# EAGLE design MPPT_LCD (EAGLE 7.4.0)
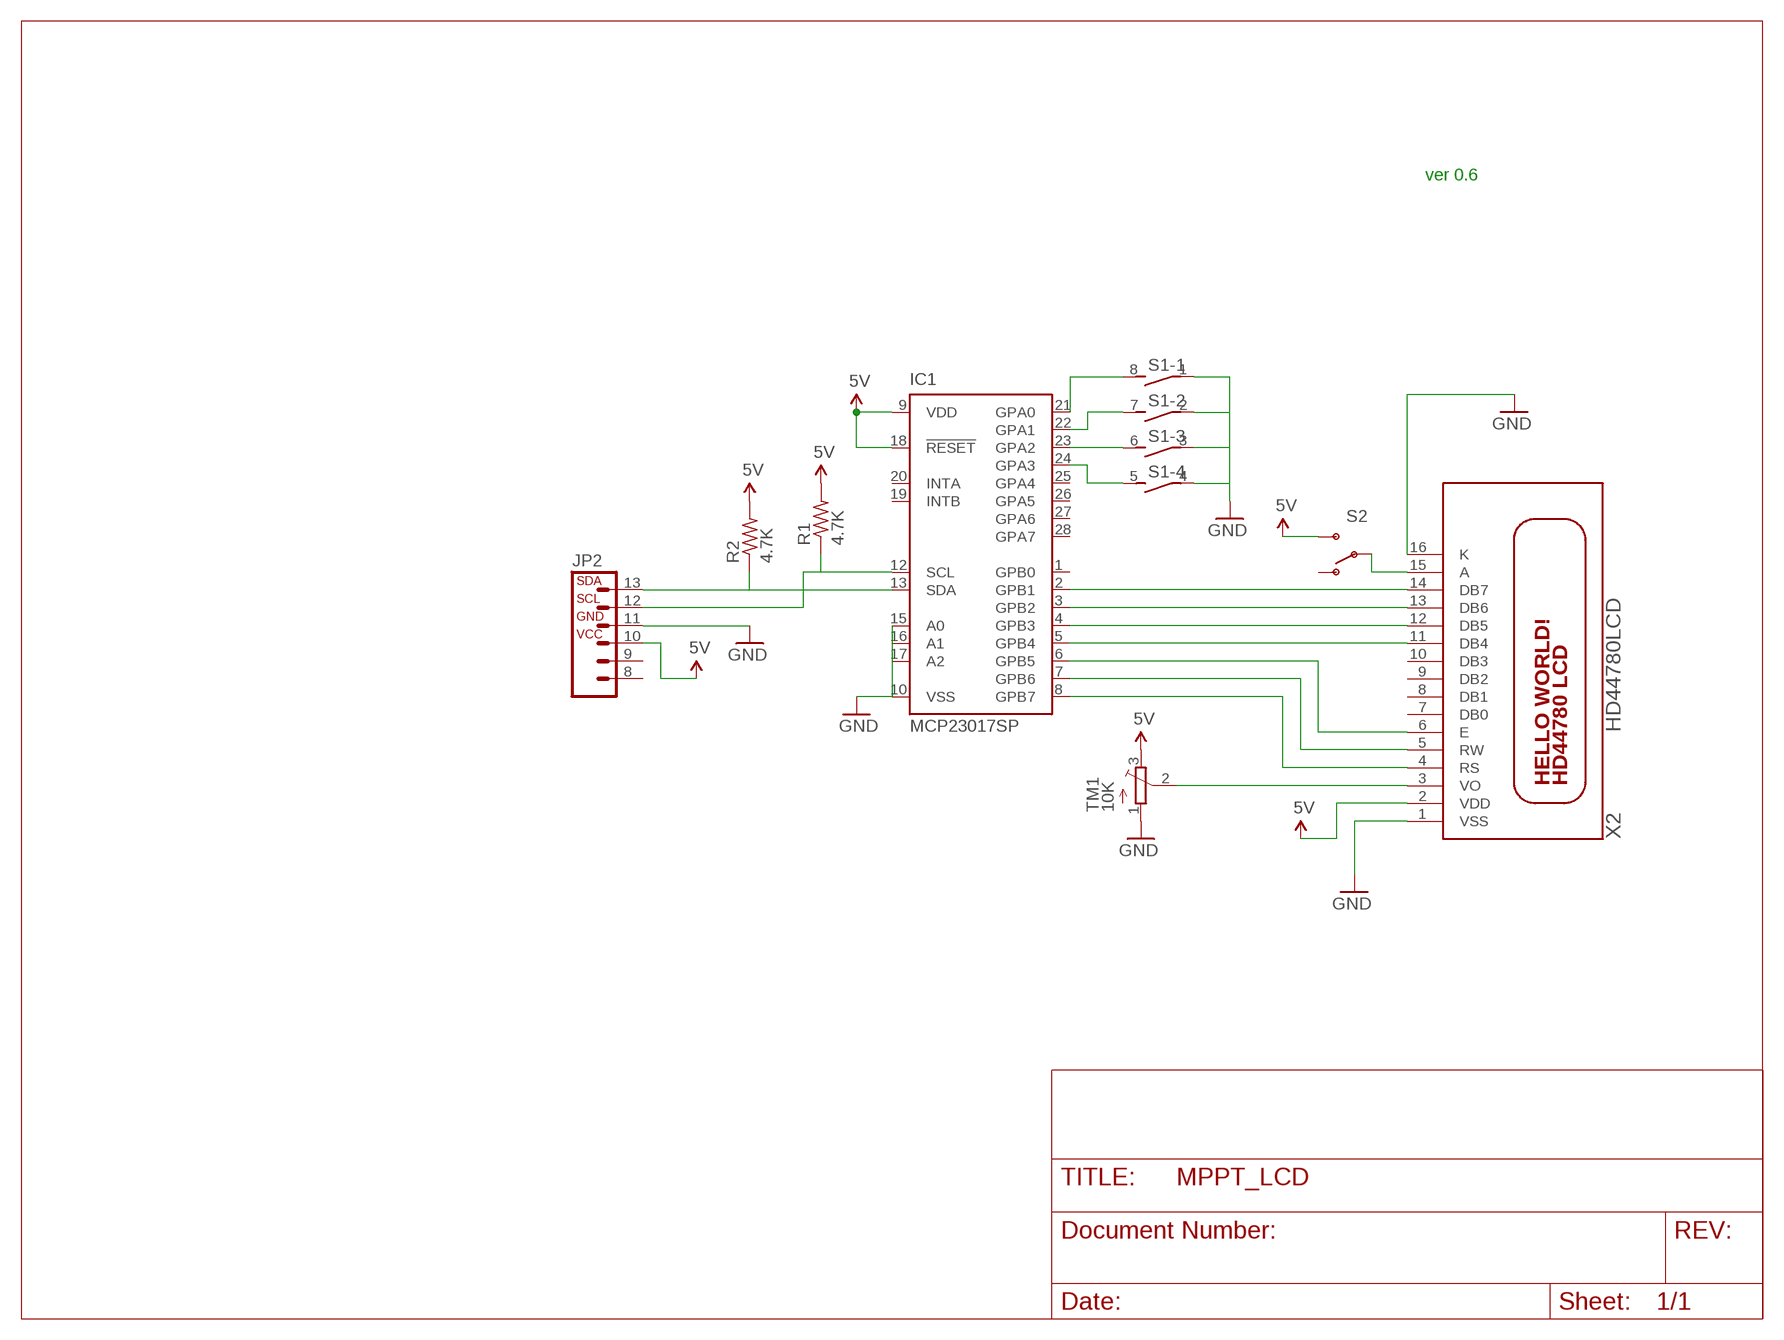
[diagram p0: schematic, sheet 1]

## Parts
IC1  MCP23017SP  [DIL28-3]
JP2  M06_MPPT_DATA  [M06_MPPT_DATA]
R1  4.7K  R-US_0207/10  [0207/10]
R2  4.7K  R-US_0207/10  [0207/10]
S1  DIP04S  [DIP04S]
S2  SWITCH-SPDTPTH  [SWITCH-SPDT]
TM1  10K  TRIMPOT  [TRIM-3386U]
X2  HD44780LCD  [LCD_40_04]

## Nets
5V: IC1.9(VDD) IC1.18(!RESET) JP2.10 R1.2 R2.2 S2.3(S) TM1.3(E) X2.2(VDD)
GND: IC1.10(VSS) IC1.15(A0) IC1.16(A1) IC1.17(A2) JP2.11 S1.1 S1.2 S1.3 S1.4 TM1.1(A) X2.1(VSS) X2.16(K)
N$2: TM1.2(S) X2.3(VO)
N$3: IC1.21(GPA0) S1.8
N$4: IC1.2(GPB1) X2.14(DB7)
N$5: IC1.3(GPB2) X2.13(DB6)
N$6: IC1.4(GPB3) X2.12(DB5)
N$7: IC1.5(GPB4) X2.11(DB4)
N$8: IC1.6(GPB5) X2.6(E)
N$9: IC1.7(GPB6) X2.5(RW)
N$10: IC1.8(GPB7) X2.4(RS)
N$11: IC1.13(SDA) JP2.13 R2.1
N$12: IC1.12(SCL) JP2.12 R1.1
N$19: IC1.22(GPA1) S1.7
N$21: IC1.23(GPA2) S1.6
N$39: IC1.24(GPA3) S1.5
N$43: S2.2(P) X2.15(A)
Unconnected: IC1.1(GPB0) IC1.19(INTB) IC1.20(INTA) IC1.25(GPA4) IC1.26(GPA5) IC1.27(GPA6) IC1.28(GPA7) JP2.8 JP2.9 S2.1(O) X2.7(DB0) X2.8(DB1) X2.9(DB2) X2.10(DB3)

## Notes on the sheet
- ver 0.6

## Library data of the parts
IC1 = adafruit:MCP23017: http://ww1.microchip.com/downloads/en/DeviceDoc/21952a.pdf Source: http://ww1.microchip.com/downloads/en/DeviceDoc/21952a.pdf
JP2 = tmb_connectors:M06_MPPT_DATA: 6 pin header for MPPT projects. Place 0 cross at x=5 y=36mm
R1 R2 = adafruit:R-US_: RESISTOR, American symbol
S1 = switch-dil:DIP04S: DIL/CODE SWITCH; OC_FARNELL: unknown; OC_NEWARK: unknown
S2 = SparkFun-Electromechanical:SWITCH-SPDT: SPDT Switch Simple slide switch, Spark Fun Electronics SKU : COM-00102 DPDT SMT slide switch, AYZ0202, SWCH-08179; PROD_ID: SWCH-08261
TM1 = tmb_trimpot:TRIMPOT: SMT trimmer potentiometer part number TC33X
X2 = tmb_display:HD44780LCD: HD44780 LCD Standard character type LCDs, available in sizes from 8x1 to 40x4!

## Board
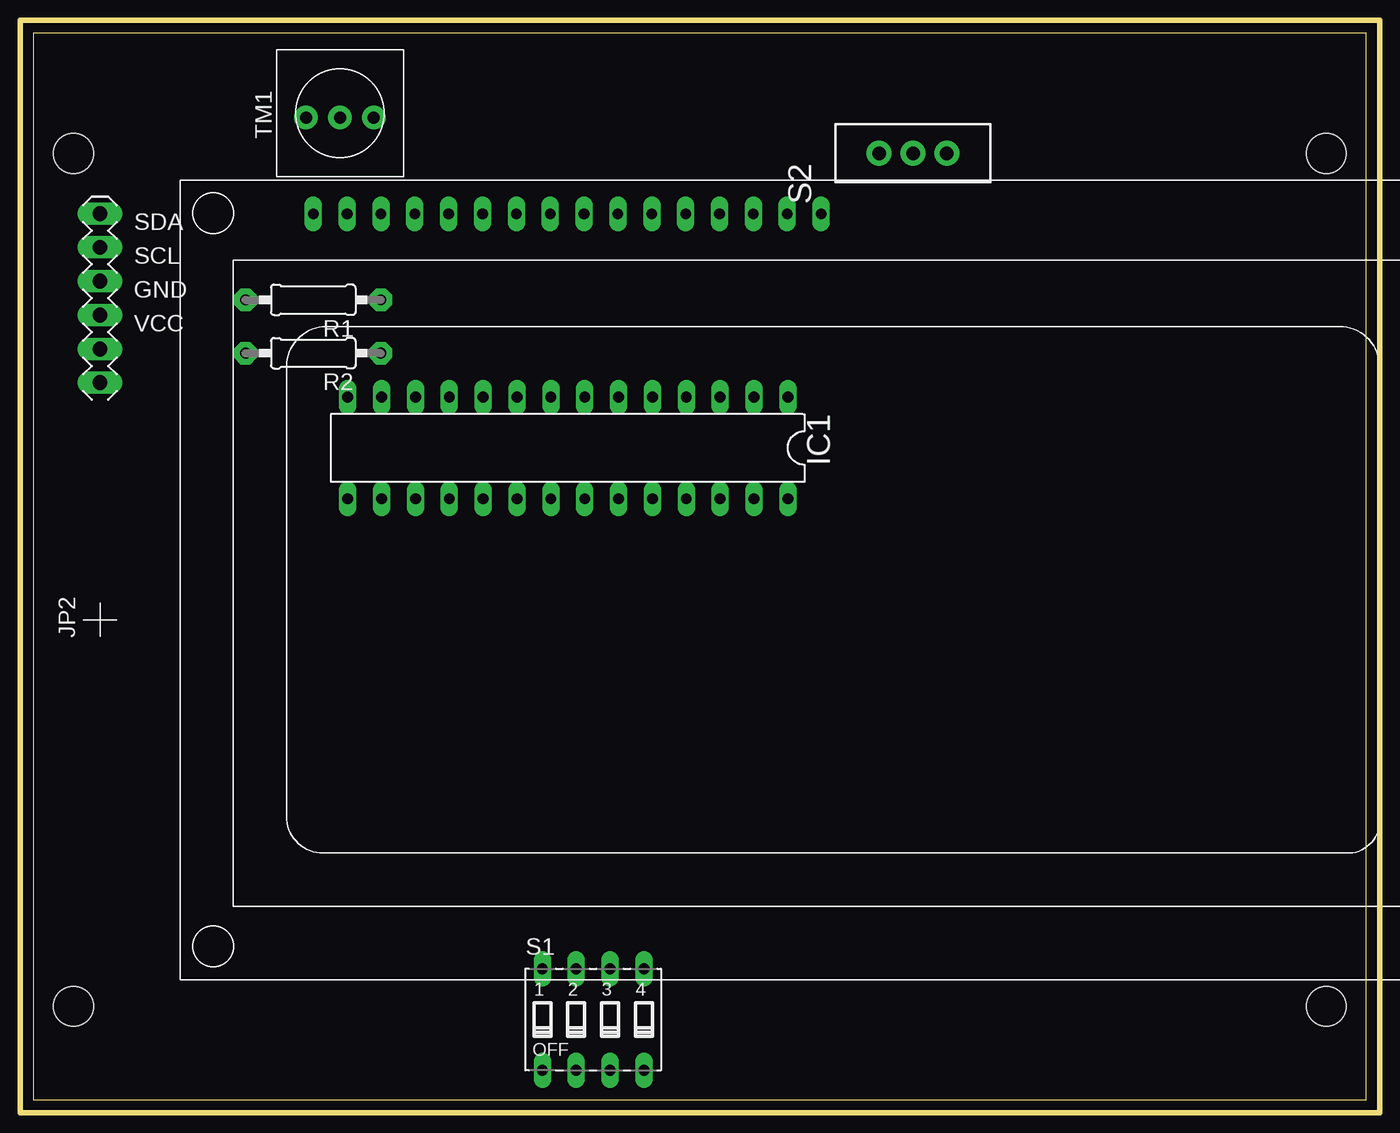
[diagram p1: board, top side]
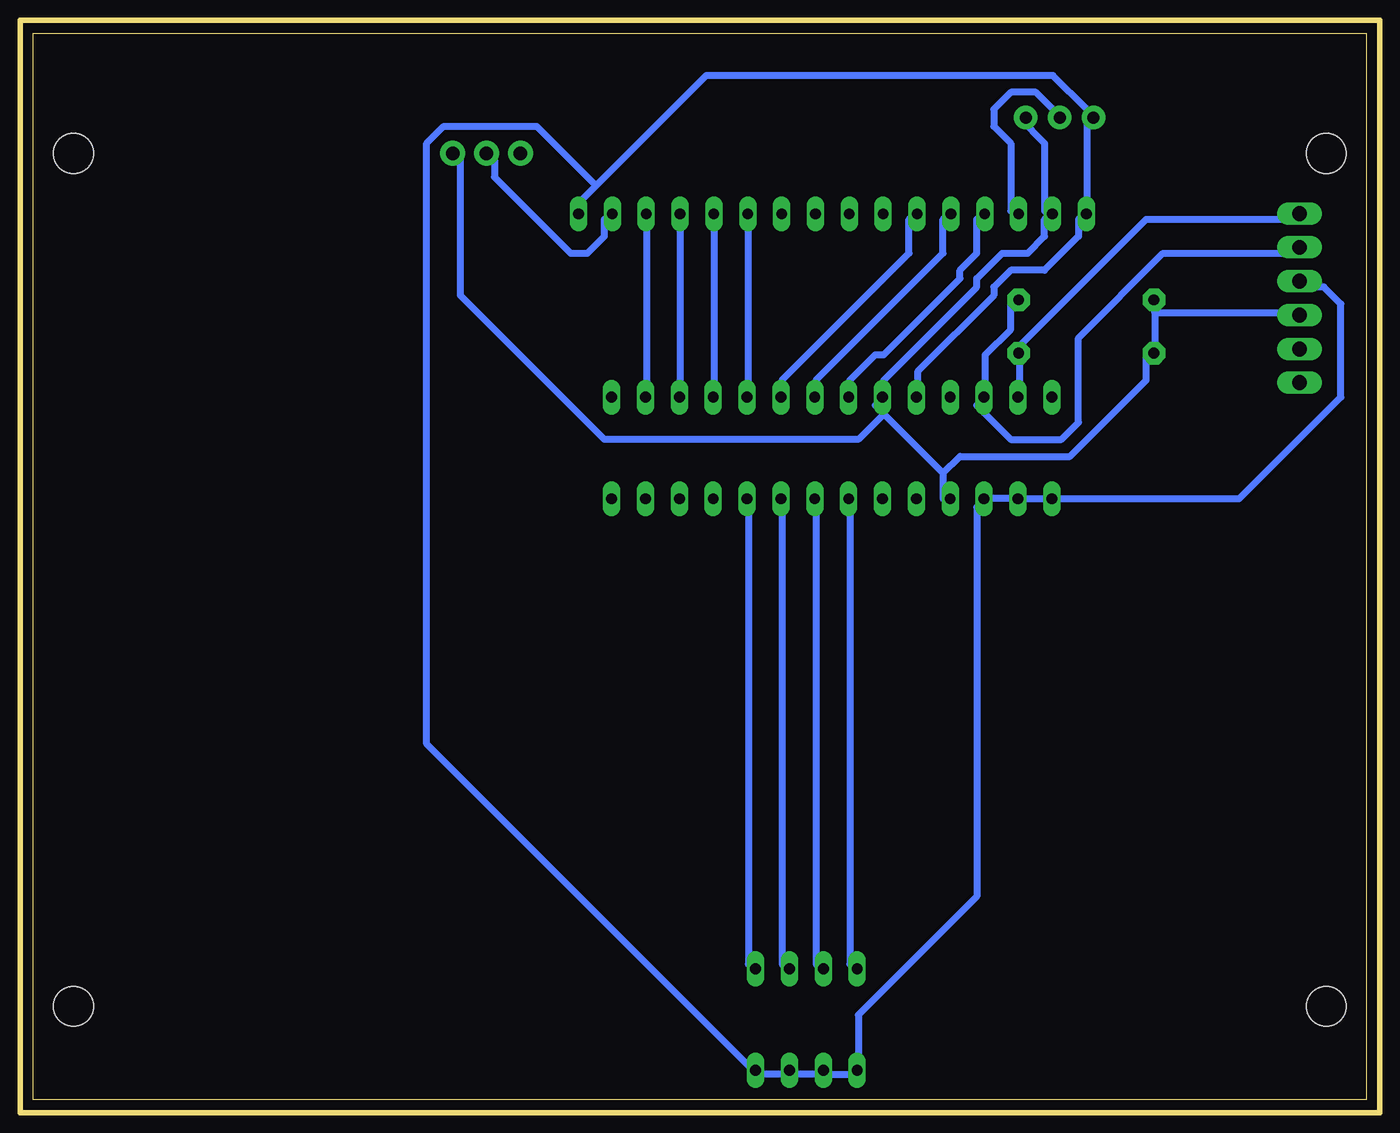
[diagram p2: board, bottom side, seen from below]

Size 100 x 80 mm. Coordinates in mm from the lower left corner, seen from the top.
Outline: 0,0 100,0 100,80 0,80 0,0
Copper layers (1*16): Top 0.035mm / dielectric 1.5mm / Bottom 0.035mm
Design rules "PCBMilling *": minimum track width 20mil, minimum drill 24mil, track to track 30mil, track to pad 20mil, pad to pad 8mil, via to via 8mil, smd to smd 8mil, copper to edge 40mil, drill to drill 8mil, minimum pad ring 10mil, minimum via ring 8mil, stop-mask expansion 4mil, vias tented up to drill 0mil, thermal gap 10mil
Holes 3 mm at 3,7 3,71 97,7 97,71
Milling: 4 lines

### Footprints (pad centres in the part's own frame; a part is rotated, then mirrored left to right if it is on the bottom)
DIL28-3 = drill 0.813 long: 1 -16.51,-3.81; 2 -13.97,-3.81; 3 -11.43,-3.81; 4 -8.89,-3.81; 5 -6.35,-3.81; 6 -3.81,-3.81; 7 -1.27,-3.81; 8 1.27,-3.81; 9 3.81,-3.81; 10 6.35,-3.81; 11 8.89,-3.81; 12 11.43,-3.81; 13 13.97,-3.81; 14 16.51,-3.81; 15 16.51,3.81; 16 13.97,3.81; 17 11.43,3.81; 18 8.89,3.81; 19 6.35,3.81; 20 3.81,3.81; 21 1.27,3.81; 22 -1.27,3.81; 23 -3.81,3.81; 24 -6.35,3.81; 25 -8.89,3.81; 26 -11.43,3.81; 27 -13.97,3.81; 28 -16.51,3.81
M06_MPPT_DATA = drill 1.118 long: 8 17.78,0; 9 20.32,0; 10 22.86,0; 11 25.4,0; 12 27.94,0; 13 30.48,0
0207/10 = drill 0.813 pad 1.676 octagon: 1 -5.08,0; 2 5.08,0
DIP04S = drill 0.813 long: 1 -3.81,-3.81; 2 -1.27,-3.81; 3 1.27,-3.81; 4 3.81,-3.81; 5 3.81,3.81; 6 1.27,3.81; 7 -1.27,3.81; 8 -3.81,3.81
SWITCH-SPDT = drill 1.016 pad 1.88: 1 0,2.54; 2 0,0; 3 0,-2.54
TRIM-3386U = drill 0.9 pad 1.778: 1 -2.54,-0.318; 2 0,-0.318; 3 2.54,-0.318
LCD_40_04 = drill 0.8 long: 1 10,57.46; 2 12.54,57.46; 3 15.08,57.46; 4 17.62,57.46; 5 20.16,57.46; 6 22.7,57.46; 7 25.24,57.46; 8 27.78,57.46; 9 30.32,57.46; 10 32.86,57.46; 11 35.4,57.46; 12 37.94,57.46; 13 40.48,57.46; 14 43.02,57.46; 15 45.56,57.46; 16 48.1,57.46

### Placement (x,y rotation side)
IC1  40.1,48.89 180 top
JP2  5,36 90 top
R1  21,60 180 top
R2  21,56 180 top
S1  42,6 0 top
S2  66,71 90 top
TM1  23,74 0 top
X2  11,9 0 top

### Tracks (layer width: path | path; a pad name or v marks a point on that pad's centre or on a via)
5V
  Bottom 0.508: 15.88,59.05 15.88,59.69 R1.2 | 15.88,59.05 15.88,56.52 R2.2 16.51,55.88 16.51,53.98 22.23,48.26 30.48,48.26 31.75,46.99 | 15.88,59.05 5.08,59.05 JP2.10 | TM1.3 26.04,73.66 24.13,71.75 24.13,66.67 X2.2 24.13,66.04 24.13,64.77 25.4,63.5 27.3,63.5 29.21,61.59 29.21,60.96 36.2,53.98 36.2,52.7 IC1.9 | 31.75,46.99 31.75,45.09 IC1.18 | 36.2,51.44 36.83,52.07 IC1.9 | 36.2,51.44 31.75,46.99 | 36.2,51.44 38.1,49.53 57.15,49.53 67.94,60.33 67.94,70.48 S2.3 | 36.2,51.44 IC1.9
GND
  Bottom 0.508: 57.78,68.58 49.53,76.83 23.5,76.83 20.95,74.3 TM1.1 20.95,73.66 20.95,66.67 X2.1 21.59,66.04 21.59,64.77 24.13,62.23 26.67,62.23 27.94,60.96 27.94,60.33 33.66,54.61 33.66,52.7 IC1.10 | 57.78,68.58 59.05,67.31 59.05,66.67 X2.16 | JP2.11 4.45,60.96 3.17,60.96 1.91,59.69 1.91,52.7 9.53,45.09 23.5,45.09 IC1.15 24.13,45.09 26.04,45.09 IC1.16 26.67,45.09 28.57,45.09 IC1.17 29.21,44.45 29.21,15.24 38.1,6.35 38.1,2.54 S1.1 38.73,1.91 40.64,1.91 S1.2 41.27,1.91 43.18,1.91 S1.3 43.81,1.91 45.72,1.91 S1.4 46.35,2.54 70.48,26.67 70.48,71.75 69.22,73.03 62.23,73.03 57.78,68.58
N$2
  Bottom 0.508: X2.3 26.67,66.67 26.67,71.75 27.94,73.03 27.94,74.3 26.67,75.56 24.77,75.56 23.5,74.3 TM1.2
N$3
  Bottom 0.508: S1.8 38.73,10.16 38.73,44.45 IC1.21
N$4
  Bottom 0.508: X2.14 53.98,66.04 53.98,52.7 IC1.2
N$5
  Bottom 0.508: X2.13 51.44,66.04 51.44,52.7 IC1.3
N$6
  Bottom 0.508: X2.12 48.9,66.04 48.9,52.7 IC1.4
N$7
  Bottom 0.508: X2.11 46.35,66.04 46.35,52.7 IC1.5
N$8
  Bottom 0.508: X2.6 34.29,66.04 34.29,63.5 43.81,53.98 43.81,52.7 IC1.6
N$9
  Bottom 0.508: X2.5 31.75,66.04 31.75,63.5 41.27,53.98 41.27,52.7 IC1.7
N$10
  Bottom 0.508: X2.4 29.21,66.04 29.21,63.5 30.48,62.23 30.48,61.59 36.2,55.88 36.83,55.88 38.73,53.98 38.73,52.7 IC1.8
N$11
  Bottom 0.508: IC1.13 26.04,52.7 26.04,55.88 R2.1 26.04,56.52 16.51,66.04 5.08,66.04 JP2.13
N$12
  Bottom 0.508: R1.1 26.67,59.69 26.67,57.78 28.57,55.88 28.57,52.7 IC1.12 29.21,52.07 26.67,49.53 22.86,49.53 21.59,50.8 21.59,57.15 15.24,63.5 5.08,63.5 JP2.12
N$19
  Bottom 0.508: S1.7 41.27,10.16 41.27,44.45 IC1.22
N$21
  Bottom 0.508: S1.6 43.81,10.16 43.81,44.45 IC1.23
N$39
  Bottom 0.508: S1.5 46.35,10.16 46.35,44.45 IC1.24
N$43
  Bottom 0.508: X2.15 57.15,66.04 57.15,64.77 58.42,63.5 59.69,63.5 65.41,69.22 65.41,70.48 S2.2